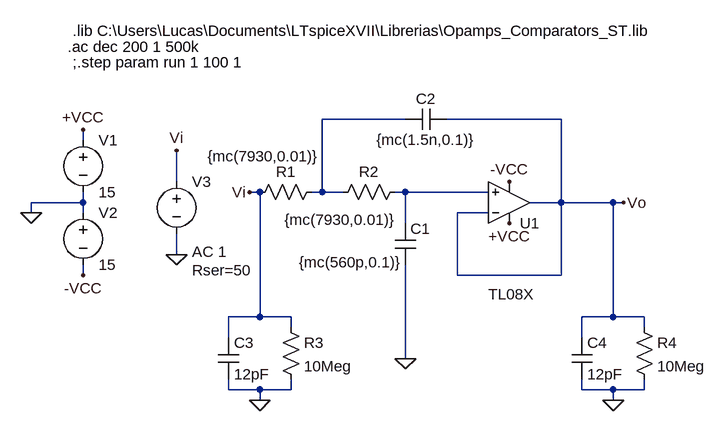
[diagram p0: schematic SegundaEtapa.asc]
SegundaEtapa.asc, the LTspice schematic file:
Version 4
SHEET 1 912 680
WIRE 448 208 320 208
WIRE 688 208 512 208
WIRE -48 240 -48 224
WIRE 96 304 96 256
WIRE 224 320 208 320
WIRE 320 320 320 208
WIRE 320 320 304 320
WIRE 352 320 320 320
WIRE 448 320 432 320
WIRE 576 320 448 320
WIRE -48 336 -48 320
WIRE -48 336 -128 336
WIRE 688 336 688 208
WIRE 688 336 640 336
WIRE 768 336 688 336
WIRE 784 336 768 336
WIRE -128 352 -128 336
WIRE -48 352 -48 336
WIRE 576 352 528 352
WIRE 448 368 448 320
WIRE 96 416 96 384
WIRE -48 448 -48 432
WIRE 528 448 528 352
WIRE 688 448 688 336
WIRE 688 448 528 448
WIRE 224 512 224 320
WIRE 224 512 176 512
WIRE 272 512 224 512
WIRE 768 512 768 336
WIRE 768 512 720 512
WIRE 816 512 768 512
WIRE 272 528 272 512
WIRE 816 528 816 512
WIRE 176 544 176 512
WIRE 720 544 720 512
WIRE 448 576 448 432
WIRE 176 624 176 608
WIRE 224 624 176 624
WIRE 272 624 272 608
WIRE 272 624 224 624
WIRE 720 624 720 608
WIRE 768 624 720 624
WIRE 816 624 816 608
WIRE 816 624 768 624
WIRE 224 640 224 624
WIRE 768 640 768 624
FLAG -128 352 0
FLAG -48 224 +VCC
FLAG -48 448 -VCC
FLAG 96 416 0
FLAG 96 256 Vi
FLAG 608 368 +VCC
FLAG 608 304 -VCC
FLAG 448 576 0
FLAG 784 336 Vo
FLAG 208 320 Vi
FLAG 224 640 0
FLAG 768 640 0
SYMBOL Opamps\\opamp2 608 400 M180
WINDOW 3 -32 -77 Left 2
SYMATTR Value TL08X
SYMATTR InstName U1
SYMBOL voltage -48 224 R0
WINDOW 123 0 0 Left 0
WINDOW 39 0 0 Left 0
SYMATTR InstName V1
SYMATTR Value 15
SYMBOL voltage -48 336 R0
WINDOW 123 0 0 Left 0
WINDOW 39 0 0 Left 0
SYMATTR InstName V2
SYMATTR Value 15
SYMBOL voltage 96 288 R0
WINDOW 123 24 124 Left 2
WINDOW 39 24 152 Left 2
SYMATTR Value2 AC 1
SYMATTR SpiceLine Rser=50
SYMATTR InstName V3
SYMATTR Value ""
SYMBOL res 320 304 R90
WINDOW 0 0 56 VBottom 2
WINDOW 3 -55 90 VTop 2
SYMATTR InstName R1
SYMATTR Value {mc(7930,0.01)}
SYMBOL res 448 304 R90
WINDOW 0 0 56 VBottom 2
WINDOW 3 43 99 VTop 2
SYMATTR InstName R2
SYMATTR Value {mc(7930,0.01)}
SYMBOL cap 432 368 R0
WINDOW 3 -148 60 Left 2
SYMATTR Value {mc(560p,0.1)}
SYMATTR InstName C1
SYMBOL cap 512 192 R90
WINDOW 0 0 32 VBottom 2
WINDOW 3 32 32 VTop 2
SYMATTR InstName C2
SYMATTR Value {mc(1.5n,0.1)}
SYMBOL cap 160 544 R0
SYMATTR InstName C3
SYMATTR Value 12pF
SYMBOL res 256 512 R0
SYMATTR InstName R3
SYMATTR Value 10Meg
SYMBOL cap 704 544 R0
SYMATTR InstName C4
SYMATTR Value 12pF
SYMBOL res 800 512 R0
SYMATTR InstName R4
SYMATTR Value 10Meg
TEXT -64 72 Left 2 !.lib C:\\Users\\Lucas\\Documents\\LTspiceXVII\\Librerias\\Opamps_Comparators_ST.lib
TEXT -72 96 Left 2 !.ac dec 200 1 500k
TEXT -64 120 Left 2 !;.step param run 1 100 1

The netlist it stands for:
* SegundaEtapa.asc
XU1 N002 Vo +VCC -VCC Vo TL08X  ; pins In+ In- V+ V- OUT
V1 +VCC 0 15
V2 0 -VCC 15
V3 Vi 0 AC 1 Rser=50
R1 N001 Vi {mc(7930,0.01)}
R2 N002 N001 {mc(7930,0.01)}
C1 N002 0 {mc(560p,0.1)}
C2 Vo N001 {mc(1.5n,0.1)}
C3 Vi 0 12pF
R3 Vi 0 10Meg
C4 Vo 0 12pF
R4 Vo 0 10Meg
.lib C:\Users\Lucas\Documents\LTspiceXVII\Librerias\Opamps_Comparators_ST.lib
.ac dec 200 1 500k
;.step param run 1 100 1
.backanno
.end

* Results of the author's LTspice run, read from the files saved beside the schematic
* Operating Point, zero values left out:
*   V(-vcc) = -15 V
*   V(+vcc) = 15 V
*   I(V2) = -1.416 mA
*   I(V1) = -1.416 mA
*   Ix(u1:4) = 1.416 mA
*   Ix(u1:5) = -1.416 mA
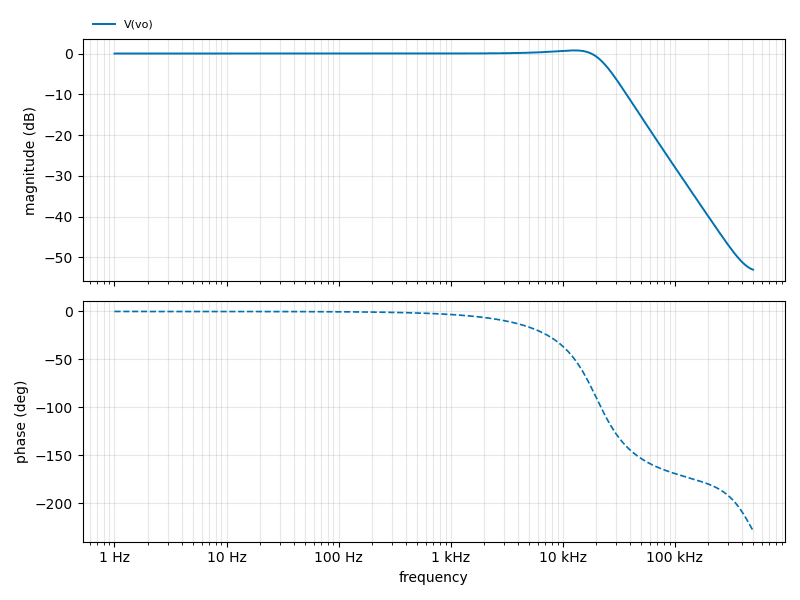
[diagram p1: AC Analysis of SegundaEtapa.asc, plotted from the saved traces]
* AC Analysis, 1 run:
*   V(vo): -0.00 dB at 1 Hz, -53.02 dB at 500 kHz, peak 0.77 dB at 12.74 kHz, 3 dB below the peak at 22.98 kHz